# Altium schematic sheet 04_DUT_Connector.SchDoc
size A4; SheetNumber: 4; SheetTotal: 4
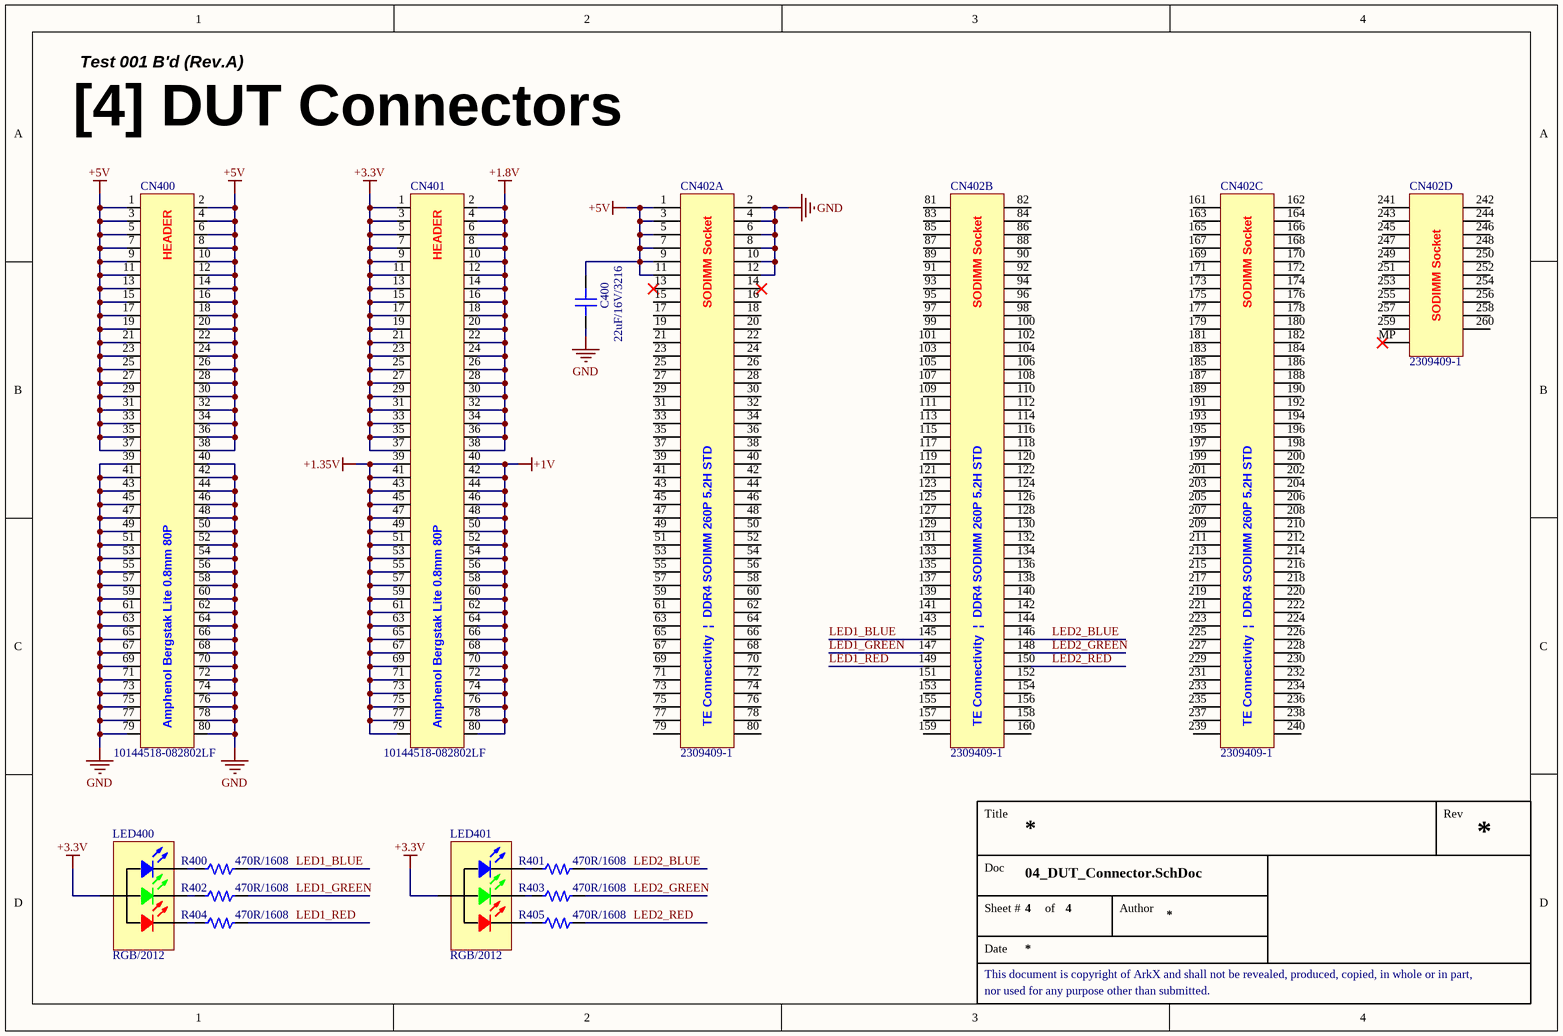
[diagram p0: 04_DUT_Connector.SchDoc]

## Parts
C400  22uF/16V/3216  [CAP 3216 (1206_INCH) - H1.8MM]
CN400  10144518-082802LF  [10144518-082802LF]
CN401  10144518-082802LF  [10144518-082802LF]
CN402  2309409-1  [CON_SODIMM_2309409-1]  (parts A,B,C,D of 4)
LED400  RGB/2012  [LED MHT170RGBCT]
LED401  RGB/2012  [LED MHT170RGBCT]
R400  470R/1608  [RES 1608 (0603_inch)]
R401  470R/1608  [RES 1608 (0603_inch)]
R402  470R/1608  [RES 1608 (0603_inch)]
R403  470R/1608  [RES 1608 (0603_inch)]
R404  470R/1608  [RES 1608 (0603_inch)]
R405  470R/1608  [RES 1608 (0603_inch)]

## Nets
+1.8V: CN401.2 CN401.4 CN401.6 CN401.8 CN401.10 CN401.12 CN401.14 CN401.16 CN401.18 CN401.20 CN401.22 CN401.24 CN401.26 CN401.28 CN401.30 CN401.32 CN401.34 CN401.36 CN401.38
+1.35V: CN401.39 CN401.41 CN401.43 CN401.45 CN401.47 CN401.49 CN401.51 CN401.53 CN401.55 CN401.57 CN401.59 CN401.61 CN401.63 CN401.65 CN401.67 CN401.69 CN401.71 CN401.73 CN401.75 CN401.77 CN401.79
+1V: CN401.40 CN401.42 CN401.44 CN401.46 CN401.48 CN401.50 CN401.52 CN401.54 CN401.56 CN401.58 CN401.60 CN401.62 CN401.64 CN401.66 CN401.68 CN401.70 CN401.72 CN401.74 CN401.76 CN401.78 CN401.80
+3.3V: CN401.1 CN401.3 CN401.5 CN401.7 CN401.9 CN401.11 CN401.13 CN401.15 CN401.17 CN401.19 CN401.21 CN401.23 CN401.25 CN401.27 CN401.29 CN401.31 CN401.33 CN401.35 CN401.37 LED400.4(Common_Anode) LED401.4(Common_Anode)
+5V: C400.2 CN400.1 CN400.2 CN400.3 CN400.4 CN400.5 CN400.6 CN400.7 CN400.8 CN400.9 CN400.10 CN400.11 CN400.12 CN400.13 CN400.14 CN400.15 CN400.16 CN400.17 CN400.18 CN400.19 CN400.20 CN400.21 CN400.22 CN400.23 CN400.24 CN400.25 CN400.26 CN400.27 CN400.28 CN400.29 CN400.30 CN400.31 CN400.32 CN400.33 CN400.34 CN400.35 CN400.36 CN400.37 CN400.38 CN402.1 CN402.3 CN402.5 CN402.7 CN402.9 CN402.11
GND: C400.1 CN400.39 CN400.40 CN400.41 CN400.42 CN400.43 CN400.44 CN400.45 CN400.46 CN400.47 CN400.48 CN400.49 CN400.50 CN400.51 CN400.52 CN400.53 CN400.54 CN400.55 CN400.56 CN400.57 CN400.58 CN400.59 CN400.60 CN400.61 CN400.62 CN400.63 CN400.64 CN400.65 CN400.66 CN400.67 CN400.68 CN400.69 CN400.70 CN400.71 CN400.72 CN400.73 CN400.74 CN400.75 CN400.76 CN400.77 CN400.78 CN400.79 CN400.80 CN402.2 CN402.4 CN402.6 CN402.8 CN402.10 CN402.12
LED1_BLUE: CN402.145 R400.2
LED1_GREEN: CN402.147 R402.2
LED1_RED: CN402.149 R404.2
LED2_BLUE: CN402.146 R401.2
LED2_GREEN: CN402.148 R403.2
LED2_RED: CN402.150 R405.2
NetLED400_1: LED400.1(RED) R404.1
NetLED400_2: LED400.2(GREEN) R402.1
NetLED400_3: LED400.3(BLUE) R400.1
NetLED401_1: LED401.1(RED) R405.1
NetLED401_2: LED401.2(GREEN) R403.1
NetLED401_3: LED401.3(BLUE) R401.1

Not connected (* = marked no-connect by the designer): CN402 13* 14* 15 16 17 18 19 20 21 22 23 24 25 26 27 28 29 30 31 32 33 34 35 36 37 38 39 40 41 42 43 44 45 46 47 48 49 50 51 52 53 54 55 56 57 58 59 60 61 62 63 64 65 66 67 68 69 70 71 72 73 74 75 76 77 78 79 80 81 82 83 84 85 86 87 88 89 90 91 92 93 94 95 96 97 98 99 100 101 102 103 104 105 106 107 108 109 110 111 112 113 114 115 116 117 118 119 120 121 122 123 124 125 126 127 128 129 130 131 132 133 134 135 136 137 138 139 140 141 142 143 144 151 152 153 154 155 156 157 158 159 160 161 162 163 164 165 166 167 168 169 170 171 172 173 174 175 176 177 178 179 180 181 182 183 184 185 186 187 188 189 190 191 192 193 194 195 196 197 198 199 200 201 202 203 204 205 206 207 208 209 210 211 212 213 214 215 216 217 218 219 220 221 222 223 224 225 226 227 228 229 230 231 232 233 234 235 236 237 238 239 240 241 242 243 244 245 246 247 248 249 250 251 252 253 254 255 256 257 258 259 260 MP*

## Notes on the sheet
- Test 001 B'd (Rev.A)
- [4] DUT Connectors
- Title
- Rev
- Doc
- Sheet #
- of
- Author
- This document is copyright of ArkX and shall not be revealed, produced, copied, in whole or in part,
- Date
- nor used for any purpose other than submitted.
- (in symbol CON_10144518-082802LF) HEADER; Amphenol Bergstak Lite 0.8mm 80P
- (in symbol CON_SODIMM_2309409-1, part A) SODIMM Socket; TE Connectivity  |  DDR4 SODIMM 260P 5.2H STD
- (in symbol CON_SODIMM_2309409-1, part B) SODIMM Socket; TE Connectivity  |  DDR4 SODIMM 260P 5.2H STD
- (in symbol CON_SODIMM_2309409-1, part C) SODIMM Socket; TE Connectivity  |  DDR4 SODIMM 260P 5.2H STD
- (in symbol CON_SODIMM_2309409-1, part D) SODIMM Socket

## Library data of the parts
C400 = CAP_22uF/16V/3216: Ceramic CAP_22uF/16V/3216; LCSC Part #: C12891; JLCPCB Part Type: Basic Part
CN400 CN401 = CON_10144518-082802LF: BergStak® Lite 0.80mm, Board-to-Board Connector, 80 Positions, Dual Row, Vertical Header; Manufacturer: Amphenol; Manufacturer Part Number: 10144518-082802LF
CN402 = CON_SODIMM_2309409-1: SO DIMM Socket, Small Outline (SO), Stack Height .205 in [5.2 mm], Right Angle Module Orientation, 260 Position, DDR4 DIMM; Manufacturer: TE Connectivity; Manufacturer Part Number: 2309409-1; JLCPCB Part Type: Extended Part; LCSC Part #: C5164025
LED400 LED401 = LED_RGB_MHT170RGBCT: Colorless transparence -30℃~+85℃ Positive post Common anode RGB 120° 0805  Light Emitting Diodes (LED) ROHS; LCSC Part #: C2962094; JLCPCB Part Type: Extended Part
R400-R405 = RES_470R/1608/0.1W: Value: 470R; Power Rating: 0.1W; Precision: 1%; Size: 1608; LCSC Part #: C23179; JLCPCB Part Type: Basic Part